# Altium project Bokskort.PrjPcb
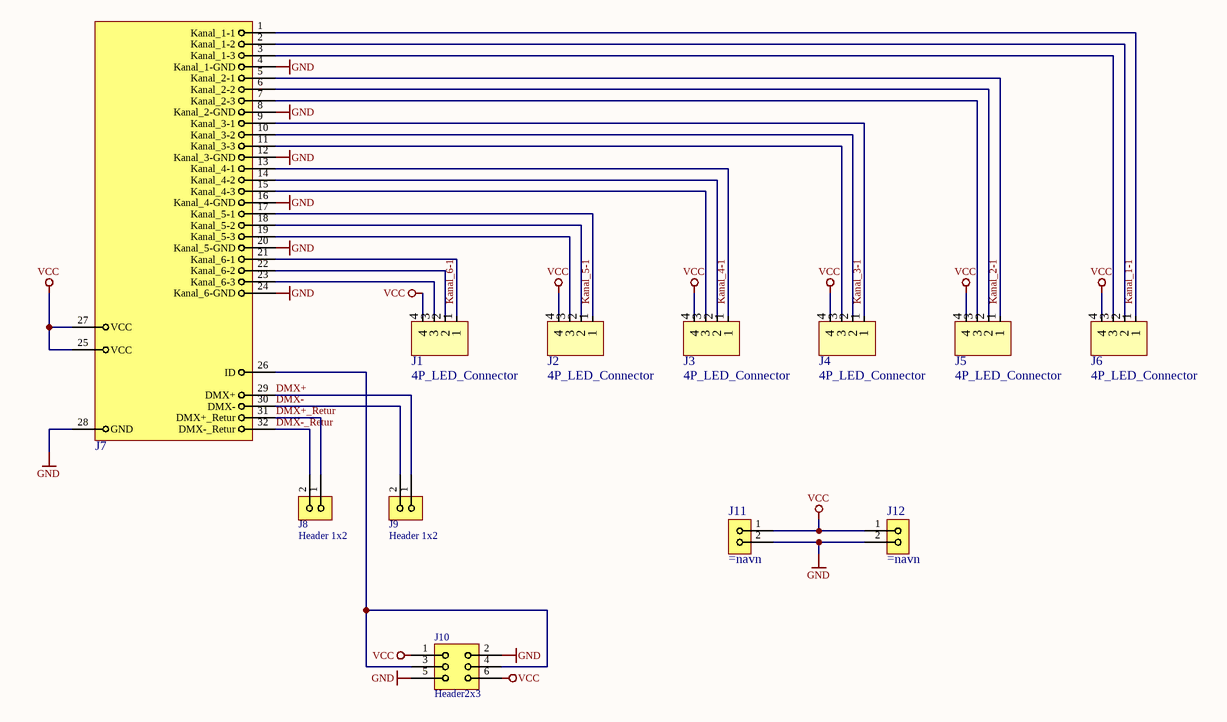
[diagram p0: Bokskort_top.SchDoc]
1 sheet, 12 parts. Net scope: global (net labels, ports and power ports of the same name join across sheets).
Board file: Bokskort.PcbDoc

## Sheet Bokskort_top.SchDoc
size A3

### Parts
J1  4P_LED_Connector  [LED_solder_connections]
J2  4P_LED_Connector  [LED_solder_connections]
J3  4P_LED_Connector  [LED_solder_connections]
J4  4P_LED_Connector  [LED_solder_connections]
J5  4P_LED_Connector  [LED_solder_connections]
J6  4P_LED_Connector  [LED_solder_connections]
J7  Lysreklameparalellbusskontakt2015_FEMALE  [HDRRAF32W64P254_2X16_4064X1260X600B]  (value not drawn)
J8  Header 1x2  [HDRV2W64P254_1X2_508X254X900B]
J9  Header 1x2  [HDRV2W64P254_1X2_508X254X900B]
J10  Header2x3  [HDRV6W64P254_2X3_762X508X900B]
J11  (no value)  [PSU_Holes_2mm]
J12  (no value)  [PSU_Holes_2mm]

### Nets
GND: J7.4(Kanal_1-GND) J7.8(Kanal_2-GND) J7.12(Kanal_3-GND) J7.16(Kanal_4-GND) J7.20(Kanal_5-GND) J7.24(Kanal_6-GND) J7.28(GND) J10.2 J10.5 J11.2 J12.2
VCC: J1.4 J2.4 J3.4 J4.4 J5.4 J6.4 J7.25(VCC) J7.27(VCC) J10.1 J10.6 J11.1 J12.1
DMX+: J7.29(DMX+) J9.1
DMX+_Retur: J7.31(DMX+_Retur) J8.1
DMX-: J7.30(DMX-) J9.2
DMX-_Retur: J7.32(DMX-_Retur) J8.2
Kanal_1-1: J6.1 J7.1(Kanal_1-1)
Kanal_2-1: J5.1 J7.5(Kanal_2-1)
Kanal_3-1: J4.1 J7.9(Kanal_3-1)
Kanal_4-1: J3.1 J7.13(Kanal_4-1)
Kanal_5-1: J2.1 J7.17(Kanal_5-1)
Kanal_6-1: J1.1 J7.21(Kanal_6-1)
NetJ1_2: J1.2 J7.22(Kanal_6-2)
NetJ1_3: J1.3 J7.23(Kanal_6-3)
NetJ2_2: J2.2 J7.18(Kanal_5-2)
NetJ2_3: J2.3 J7.19(Kanal_5-3)
NetJ3_2: J3.2 J7.14(Kanal_4-2)
NetJ3_3: J3.3 J7.15(Kanal_4-3)
NetJ4_2: J4.2 J7.10(Kanal_3-2)
NetJ4_3: J4.3 J7.11(Kanal_3-3)
NetJ5_2: J5.2 J7.6(Kanal_2-2)
NetJ5_3: J5.3 J7.7(Kanal_2-3)
NetJ6_2: J6.2 J7.2(Kanal_1-2)
NetJ6_3: J6.3 J7.3(Kanal_1-3)
NetJ7_26: J7.26(ID) J10.3 J10.4

### Library data of the parts
J8 J9 = Header 1x2: 2,54mm pitch; pakke_opprettet_av: 815; pris: 1; pakketype: 92; id: 2429; navn: Header 1x2; pakke_opprettet: 13.11.2014 12:30:48; symbol_opprettet_av: 815; symbol_opprettet: 13.11.2014 10:58:53
J10 = Header 2x3: 2,54mm pitch; pakke_opprettet_av: 815; pris: 3; pakketype: 92; id: 3187; navn: Header 2x3; pakke_opprettet: 23.07.2015 20:17:54; symbol_opprettet_av: 815; symbol_opprettet: 13.11.2014 11:03:43
J11 J12 = 2PConnector